# Altium schematic sheet Fan control hot air.SchDoc
size A4; SheetNumber: 7; SheetTotal: 8
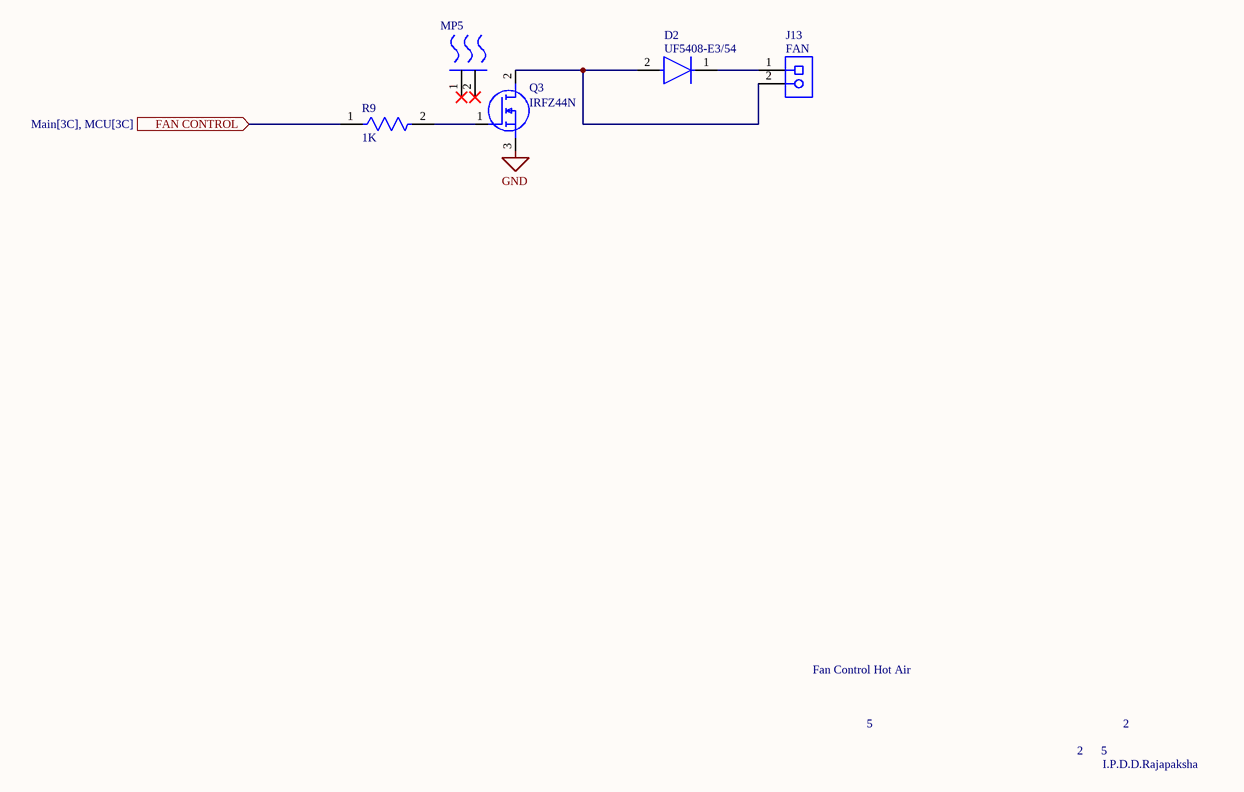
[diagram p0: Fan control hot air.SchDoc]

## Parts
D2  UF5408-E3/54  [FP-UF5408-E3-54-MFG]
J13  Parameter 1: FAN  [PHOE-1729128-2_V]  (hidden comment: 1729128)
MP5  WV-T264-101E  [FP-WV-T264-101E-MFG]  (value not drawn)
Q3  IRFZ44N  [TO254P440X1000X1900-3P]
R9  value 1K  [FP-CMF50-0]  (hidden comment: CMF5073K200FHEB)

## Ports
FAN CONTROL (in, see Main[3C], MCU[3C])

## Nets
GND: Q3.3(S)
FAN CONTROL: R9.1 ; port FAN CONTROL
NetD2_1: D2.1(C) J13.1
NetD2_2: D2.2(A) J13.2 Q3.2(D)
NetQ3_1: Q3.1(G) R9.2

Not connected (* = marked no-connect by the designer): MP5 1(MNT_1)* 2(MNT_2)*

## Notes on the sheet
- Fan Control Hot Air
- 5
- 2      5
- 2
- I.P.D.D.Rajapaksha

## Library data of the parts
D2 = CMP-02540-000083-1: DIODE GEN PURP 1KV 3A DO201AD; Capacitance: 36pF; Recovery Time: 75ns; Max Reverse Current: 10uA; Outside Diameter: 5.3mm; Forward Voltage: 1.7V; Peak Non-Repetitive Surge Current: 150A; Element Configuration: Single; Polarity: Standard; Average Rectified Current: 3A; Width: 5.3mm; Mount: Through Hole; Number of Pins: 2; Case/Package: DO-201AD; Series: -; Max Repetitive Reverse Voltage (Vrrm): 1kV; Packaging: Tape and Reel; Max Surge Current: 150A; Length: 9.5mm; Lead Free: Lead Free; Termination: Axial; Reverse Recovery Time-Max: 75ns; Max Operating Temperature: 150°C; Height: 5.3mm; Forward Current: 3A; Radiation Hardening: No; RoHS Compliant: Yes; Min Operating Temperature: -55°C; Output Current: 3A; Reverse Voltage: 1kV; Reverse Recovery Time: 75ns; Max Forward Surge Current (Ifsm): 150A; Package Quantity: 1; Max Reverse Voltage (DC): 1kV
J13 = CMP-2000-05815-1: PCB Terminal Block, 13.5 A, 400 V, 2-Pin THD, RoHS, Bulk; Manufacturer: Phoenix Contact; Package Version: 03/2015; No. of Rows: 1; Pitch: 5.08mm; No. of Positions: 2; Voltage Rating: 400V; Current Rating: 13500mA; Manufacturer URL: http://www.phoenixcontact.com/; Datasheet URL: https://datasheet.ciiva.com/16046/1729128-16046181.pdf; RoHS: TRUE; Package URL: https://www.phoenixcontact.com/online/portal/pi/pxc/product_detail_page/!ut/p/b1/3VdJjqNKFDxLH8AFycySyWY2ozFsEPOMMQaDOX1XedGL_1Vdm5YXJleknhSKeBkvI6EA8ncAo3AYoDhBQGco6KN7VURTdemj9us_IEKEZo_YHiPAEWEFmDGOHMORkqKYCORBZxgL7ZoaZYcbFFUZ3fqxSY6GOuxydWUuHqz1ynmMFygu583Bob0Ewr6Sd_l-5m-kAueHiB0jpRwZwe58wwtkpxtMYd_LmGcDRU02dRNEyWt6Y2ti5pSyJ_reIkzIulrqApdnbT11V5jnCKbYNCvhEM1MCpPByat_X379-iThf08CI5GfOPqfBeS3BRoBOdD55AKVv0iLwCMq-2BrzXWSGRH7pUGD9uwXQjiph3xL0DKQwdGa0JImiIOmBNOestqgwTHSSs2oOep-78apyXQBvNi8ZLaFjvjWvcaUEBu0MC6Wbe-d6mB0FAebo2lUWinqYaZs5DAYzV0RP9yitUjnGJ0iI9xhZkT42OCQNUJJhkgWINNQLP2JFP6OpMg3JCVg70jqHT0lvKOnhHf0lPuOnnLf0VPuWx6_dxwUIvwk5WMkT0kLL1mh61l2yZVSzG3pYV_bqo-mj6uMKwKwdnnW8Jh5RTOJzMOA5c-eJDaZQw4mTMPH02PvS_ZAqNVjVTo2WyYLkwH_KU1mmmG5kjRhDqPXLwwVHvVOjCM60-fpXvTDfMGW1PVFVS1r4e4yVDk4ZdNbkUHvqPqQSeian4UD39fNKmachqdJ1NJbyk8rXT9mXTvPk3oE5meulKGgiruPJek-4I9hTT6G8ZLOyRSm2RRVbThERQad5OS28hdt4YW4vG0stgYYzsWsK4_7y6DZMjJSCqri1kyiZR5vD7pwIrNR7QwPHTcLTI5qT7eRlpHrdGiupYlqQDJ7zy_CND8fWWBoLRXxk1RVcXiBQwbTD4Xi7KL-FuO94t9xaqweXzH; PartNumber: 1729128; Package Description: 2-Pin Through Hole Device, Body 8.1 x 10.16 mm, Pitch 5.08 mm; Datasheet Version: 12/2013; Mounting Technology: ThroughHole; Orientation: Horizontal; Package Reference: 1729128-2; Packing: Bulk
MP5 = CMP-33535-000032-1: HEATSINK W/CLIP FOR TO-264; Natural Thermal Resistance: 12°C/W; Shape: Fins; Thermal Resistance @ Forced Air Flow (100 LFM): 8°C/W; Width: 23.4mm; Weight: 0.42oz; Package Quantity: 10; RoHS Compliant: Yes; Mount: Clip; Package Cooled: TO-264; Height Off Base: 0.63inch; Height: 32mm; Packaging: Bulk; Series: W; Case/Package: TO-264; Length: 1.26inch; Material: Aluminium
Q3 = IRFZ44N: MOSFET (N-Channel); Manufacturer_Name: Inchange Semiconductor; Datasheet Link: https://4donline.ihs.com/images/VipMasterIC/IC/INSE/INSES02201/INSES02201-1.pdf?hkey=EF798316E3902B6ED9A73243A3159BB0; Height: 4.4mm; Manufacturer_Part_Number: IRFZ44N
R9 = CMP-00030-44386654-1: CMF5073K200FHEB Res Metal Film 73.2K Ohm 1% 0.125W(1/8W) ±50ppm/°C Epoxy AXL T/R; Max Power Dissipation: 250mW; Voltage Rating: 200V; Power Rating: 125mW; Resistance: 73.2kΩ; Tolerance: 1%; Width: 1.65mm; Length: 3.81mm; Schedule B: 8533210090, 8533210090; Termination: Axial; Lead Free: Lead Free; Diameter: 1.65mm; Voltage Rating (DC): 200V; NexarPartId: 44386654; Packaging: Cut Tape; Max Operating Temperature: 175°C; Composition: Metal Film; RoHS: Compliant; Mount: Through Hole; Features: Flame Retardant Coating, Moisture Resistant; Number of Terminations: 2; Temperature Coefficient: 50ppm/°C; Min Operating Temperature: -55°C; Case/Package: Axial